# EAGLE design LED_Light_Quad (EAGLE 6.5.0)
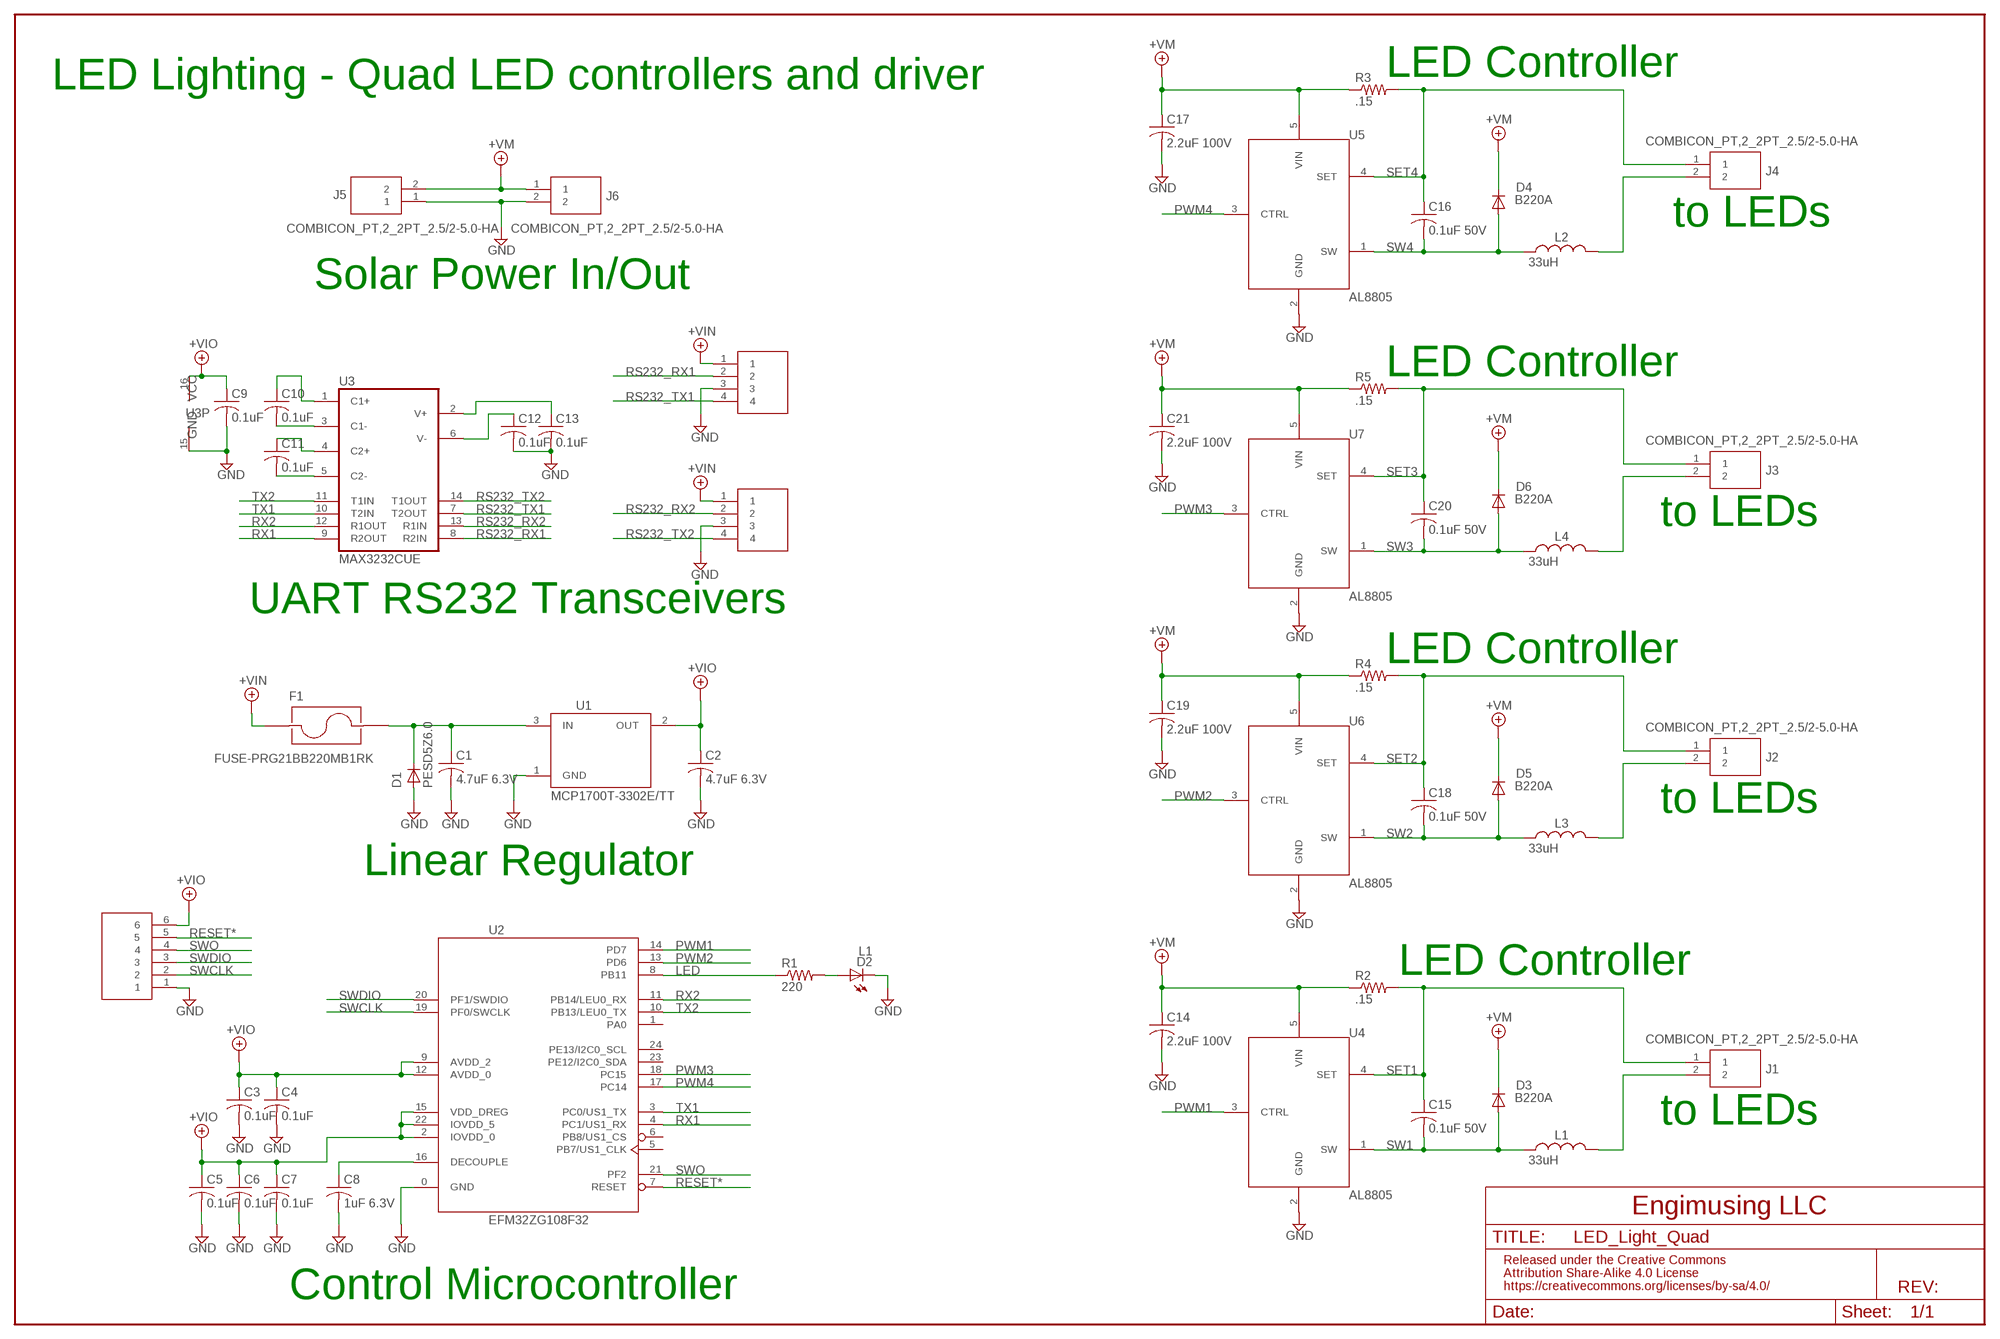
[diagram p0: schematic, sheet 1]

## Parts
C1  4.7uF 6.3V  C-USC0603  [C0603]
C2  4.7uF 6.3V  C-USC0603  [C0603]
C3  0.1uF  C-USC0402  [C0402]
C4  0.1uF  C-USC0402  [C0402]
C5  0.1uF  C-USC0402  [C0402]
C6  0.1uF  C-USC0402  [C0402]
C7  0.1uF  C-USC0402  [C0402]
C8  1uF 6.3V  C-USC0603  [C0603]
C9  0.1uF  C-USC0402  [C0402]
C10  0.1uF  C-USC0402  [C0402]
C11  0.1uF  C-USC0402  [C0402]
C12  0.1uF  C-USC0402  [C0402]
C13  0.1uF  C-USC0402  [C0402]
C14  2.2uF 100V  C-USC1210K  [C1210K]
C15  0.1uF 50V  C-USC0805  [C0805]
C16  0.1uF 50V  C-USC0805  [C0805]
C17  2.2uF 100V  C-USC1210K  [C1210K]
C18  0.1uF 50V  C-USC0805  [C0805]
C19  2.2uF 100V  C-USC1210K  [C1210K]
C20  0.1uF 50V  C-USC0805  [C0805]
C21  2.2uF 100V  C-USC1210K  [C1210K]
D1  PESD5Z6.0  DIODESOD-523  [SOD-523]
D2  L1  LEDCHIP-LED0603  [CHIP-LED0603]
D3  B220A  DIODE  [DO214SMA]
D4  B220A  DIODE  [DO214SMA]
D5  B220A  DIODE  [DO214SMA]
D6  B220A  DIODE  [DO214SMA]
F1  FUSE-PRG21BB220MB1RK  [L0805_2.5]
J1  COMBICON_PT,2_2PT_2.5/2-5.0-HA  [PT_2,5/2-5.0-HA]
J2  COMBICON_PT,2_2PT_2.5/2-5.0-HA  [PT_2,5/2-5.0-HA]
J3  COMBICON_PT,2_2PT_2.5/2-5.0-HA  [PT_2,5/2-5.0-HA]
J4  COMBICON_PT,2_2PT_2.5/2-5.0-HA  [PT_2,5/2-5.0-HA]
J5  COMBICON_PT,2_2PT_2.5/2-5.0-HA  [PT_2,5/2-5.0-HA]
J6  COMBICON_PT,2_2PT_2.5/2-5.0-HA  [PT_2,5/2-5.0-HA]
L1  33uH  INDUCTOR  [SRN6045]
L2  33uH  INDUCTOR  [SRN6045]
L3  33uH  INDUCTOR  [SRN6045]
L4  33uH  INDUCTOR  [SRN6045]
P1  DF11-4_STRAIGHT_PIN  [DF11SP-4-H]
P2  DF11-4_STRAIGHT_PIN  [DF11SP-4-H]
P3  DF11-6_STRAIGHT_PIN  [DF11SP-6-H]
R1  220  R-USR0402  [R0402]
R2  .15  R-USR0805  [R0805]
R3  .15  R-USR0805  [R0805]
R4  .15  R-USR0805  [R0805]
R5  .15  R-USR0805  [R0805]
U1  MCP1700T-3302E/TT  MCP1700-3302E/TT  [SOT23A]
U2  EFM32ZG108F32  [QFN24_5X5]
U3  MAX3232CUE  [TSSOP16]
U4  AL8805  [SOT-23-5A]
U5  AL8805  [SOT-23-5A]
U6  AL8805  [SOT-23-5A]
U7  AL8805  [SOT-23-5A]

## Nets
+VIN: F1.2(A) P1.1 P2.1
+VIO: C2.1 C3.1 C4.1 C5.1 C6.1 C7.1 C9.1 P3.6 U1.2(OUT) U2.2(IOVDD_0) U2.9(AVDD_2) U2.12(AVDD_0) U2.15(VDD_DREG) U2.22(IOVDD_5) U3.16(VCC)
+VM: C14.1 C17.1 C19.1 C21.1 D3.1(C) D4.1(C) D5.1(C) D6.1(C) J5.2 J6.1 R2.1 R3.1 R4.1 R5.1 U4.5(VIN) U5.5(VIN) U6.5(VIN) U7.5(VIN)
GND: C1.2 C2.2 C3.2 C4.2 C5.2 C6.2 C7.2 C8.2 C9.2 C12.2 C13.2 C14.2 C17.2 C19.2 C21.2 D1.A D2.C J5.1 J6.2 P1.3 P2.3 P3.1 U1.1(GND) U2.0(GND) U3.15(GND) U4.2(GND) U5.2(GND) U6.2(GND) U7.2(GND)
LED: R1.1 U2.8(PB11)
N$1: C8.1 U2.16(DECOUPLE)
N$2: J1.2 L1.2
N$3: J4.2 L2.2
N$4: J2.2 L3.2
N$5: D2.A R1.2
N$6: J3.2 L4.2
N$43: C10.2 U3.3(C1-)
N$44: C10.1 U3.1(C1+)
N$45: C11.2 U3.5(C2-)
N$46: C11.1 U3.4(C2+)
N$54: C13.1 U3.2(V+)
N$55: C12.1 U3.6(V-)
PWM1: U2.14(PD7) U4.3(CTRL)
PWM2: U2.13(PD6) U6.3(CTRL)
PWM3: U2.18(PC15) U7.3(CTRL)
PWM4: U2.17(PC14) U5.3(CTRL)
RESET*: P3.5 U2.7(RESET)
RS232_RX1: P2.2 U3.8(R2IN)
RS232_RX2: P1.2 U3.13(R1IN)
RS232_TX1: P2.4 U3.7(T2OUT)
RS232_TX2: P1.4 U3.14(T1OUT)
RX1: U2.4(PC1/US1_RX) U3.9(R2OUT)
RX2: U2.11(PB14/LEU0_RX) U3.12(R1OUT)
SET1: C15.1 J1.1 R2.2 U4.4(SET)
SET2: C18.1 J2.1 R4.2 U6.4(SET)
SET3: C20.1 J3.1 R5.2 U7.4(SET)
SET4: C16.1 J4.1 R3.2 U5.4(SET)
SW1: C15.2 D3.2(A) L1.1 U4.1(SW)
SW2: C18.2 D5.2(A) L3.1 U6.1(SW)
SW3: C20.2 D6.2(A) L4.1 U7.1(SW)
SW4: C16.2 D4.2(A) L2.1 U5.1(SW)
SWCLK: P3.2 U2.19(PF0/SWCLK)
SWDIO: P3.3 U2.20(PF1/SWDIO)
SWO: P3.4 U2.21(PF2)
TX1: U2.3(PC0/US1_TX) U3.10(T2IN)
TX2: U2.10(PB13/LEU0_TX) U3.11(T1IN)
VIN: C1.1 D1.K(C) F1.1(B) U1.3(IN)
Unconnected: U2.1(PA0) U2.5(PB7/US1_CLK) U2.6(PB8/US1_CS) U2.23(PE12/I2C0_SDA) U2.24(PE13/I2C0_SCL)

## Notes on the sheet
- LED Lighting - Quad LED controllers and driver | LED Controller
- to LEDs
- Solar Power In/Out
- LED Controller
- to LEDs
- UART RS232 Transceivers
- LED Controller
- to LEDs
- Linear Regulator
- LED Controller
- to LEDs
- Control Microcontroller

## Library data of the parts
C1-C7 C9-C13 = cc_rcl:C-US: CAPACITOR, American symbol
C8 C14-C21 = Engimusing:C-US: CAPACITOR, American symbol
D1 D3-D6 = Engimusing:DIODE: Diode SMA Model Volts Amps Type Vf Vr Digikey # Notes SSA34-E3 40V 3A Schottky 480mV @ 3A 200uA @ 40V SSA34-E3/61TGITR-ND CDBA120-G 20V 1A Schottky 500mV @ 1A 500uA @ 20V 641-1014-6-ND REEL MBRA210 10V 2A Schottky 350mV @ 2A 700uA @ 10V MBRA210LT3 SOD-123 Model Volts Amps Type Vf Vr Order # Notes BAT54T1G 30V 200mA Schottky 800mV @ 200mA 2uA @ 25V BAT54T1GOSTR-ND B0530W 30V 500mA Schottky 430mV @ 500mA 130uA @ 30V B0530W-FDICT-ND REEL MBR120 1A 20V Schottky 340mV @ 1A MBR120VLSFT1GOSCT-ND SOD-323 Model Volts Amps Type Vf Vr Order # Notes PMEG2005EJ 20V 500mA Schottky 355mV @ 500mA 568-4110-1-ND ZLLS410 10V 570mA Schottky 380mV @ 570mA ZLLS410CT-ND 1N4148WS 75V 150mA Silicon/Simple 1V 1N4148WSFSCT-ND REEL SOD-523 Model Volts Amps Type Vf Vr Order # Notes BAT54XV2 30V 200mA Schottky 0.8V @ 100mA BAT54XV2CT-ND TB751S 30V 30mA Schottky RB751S-40TE61CT-ND SOT23-R/W (R = Solder Paste/Reflow Ovens, W = Hand-Soldering) Model Volts Amps Type Vf Vr Order # Notes BAT54FILM 40V 300mA Schottky 497-7162-1-ND
D2 = led:LED: LED OSRAM: - CHIPLED LG R971, LG N971, LY N971, LG Q971, LY Q971, LO R971, LY R971 LH N974, LH R974 LS Q976, LO Q976, LY Q976 LO Q996 - Hyper CHIPLED LW Q18S LB Q993, LB Q99A, LB R99A - SideLED LS A670, LO A670, LY A670, LG A670, LP A670 LB A673, LV A673, LT A673, LW A673 LH A674 LY A675 LS A676, LA A676, LO A676, LY A676, LW A676 LS A679, LY A679, LG A679 - Hyper Micro SIDELED® LS Y876, LA Y876, LO Y876, LY Y876 LT Y87S - SmartLED LW L88C, LW L88S LB L89C, LB L89S, LG L890 LS L89K, LO L89K, LY L89K LS L896, LA L896, LO L896, LY L896 - TOPLED LS T670, LO T670, LY T670, LG T670, LP T670 LSG T670, LSP T670, LSY T670, LOP T670, LYG T670 LG T671, LOG T671, LSG T671 LB T673, LV T673, LT T673, LW T673 LH T674 LS T676, LA T676, LO T676, LY T676, LB T676, LH T676, LSB T676, LW T676 LB T67C, LV T67C, LT T67C, LS T67K, LO T67K, LY T67K, LW E67C LS E67B, LA E67B, LO E67B, LY E67B, LB E67C, LV E67C, LT E67C LW T67C LS T679, LY T679, LG T679 LS T770, LO T770, LY T770, LG T770, LP T770 LB T773, LV T773, LT T773, LW T773 LH T774 LS E675, LA E675, LY E675, LS T675 LS T776, LA T776, LO T776, LY T776, LB T776 LHGB T686 LT T68C, LB T68C - Hyper Mini TOPLED® LB M676 - Mini TOPLED Santana® LG M470 LS M47K, LO M47K, LY M47K Source: http://www.osram.convergy.de LUXEON: - LUMILED® LXK2-PW12-R00, LXK2-PW12-S00, LXK2-PW14-U00, LXK2-PW14-V00 LXK2-PM12-R00, LXK2-PM12-S00, LXK2-PM14-U00 LXK2-PE12-Q00, LXK2-PE12-R00, LXK2-PE12-S00, LXK2-PE14-T00, LXK2-PE14-U00 LXK2-PB12-K00, LXK2-PB12-L00, LXK2-PB12-M00, LXK2-PB14-N00, LXK2-PB14-P00, LXK2-PB14-Q00 LXK2-PR12-L00, LXK2-PR12-M00, LXK2-PR14-Q00, LXK2-PR14-R00 LXK2-PD12-Q00, LXK2-PD12-R00, LXK2-PD12-S00 LXK2-PH12-R00, LXK2-PH12-S00 LXK2-PL12-P00, LXK2-PL12-Q00, LXK2-PL12-R00 Source: www.luxeon.com KINGBRIGHT: KA-3528ASYC Source: www.kingbright.com
F1 = Engimusing:FUSE
J1-J6 = Engimusing:COMBICON_PT,2_2: CONNECTOR 2POS SCREW CONECTON
L1-L4 = Engimusing:INDUCTOR
P1 P2 = engimusing_conectors:DF11-4: CONNECTOR 4 POS SM
P3 = engimusing_conectors:DF11-6: CONNEECTOR 6 POS SM
R1 = cc_rcl:R-US: RESISTOR, American symbol
R2-R5 = Engimusing:R-US: RESISTOR, American symbol
U1 = Engimusing:MCP1700
U2 = Engimusing:EFM32ZG108
U3 = maxim:MAX3232*: True RS-232 Transceivers 3.0V to 5.5V, Low-Power up to 1Mbps, Using Four 0.1µF External Capacitors Source: http://pdfserv.maxim-ic.com/en/ds/MAX3222-MAX3241.pdf; MF: MAXIM; MPN: MAX3232CUE+; OC_FARNELL: 1593350; OC_NEWARK: 68K4629
U4-U7 = Engimusing:AL8805

## Net classes
2 gnd: width 0.254 mm, drill 0.61 mm, clearance 0.254 mm

## Board
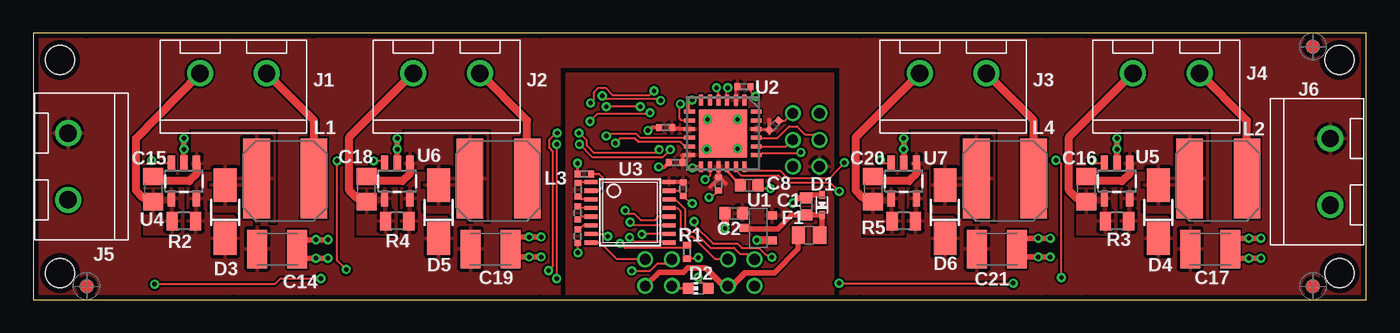
[diagram p1: board, top side]
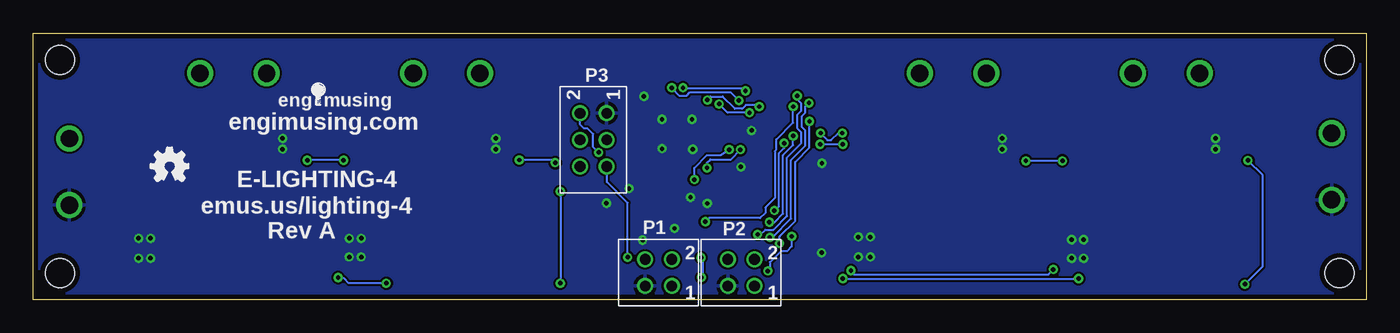
[diagram p2: board, bottom side, seen from below]

Size 100 x 20 mm. Coordinates in mm from the lower left corner, seen from the top.
Outline: 4,0 15,0
Outline: 15,20 4,20
Outline: 76,0 96,0
Outline: 96,20 76,20
Outline: 21,0 38,0
Outline: 38,20 21,20
Outline: 62,0 79,0
Outline: 79,20 62,20
Outline: 0,0 100,0 100,20 0,20 0,0
Copper layers (1*16): Top 0.0356mm / dielectric 1.5011mm / Bottom 0.0356mm
Design rules "OshPark-2Lyr *": minimum track width 6mil, minimum drill 13mil, track to track 6mil, track to pad 6mil, pad to pad 6mil, via to via 6mil, smd to smd 6mil, copper to edge 15mil, drill to drill 6mil, minimum pad ring 7mil, minimum via ring 7mil, stop-mask expansion 3mil, vias tented up to drill 13mil, thermal gap 10mil
Holes 2.2 mm at 98,18 2,2 2,18 98,2

### Footprints (pad centres in the part's own frame; a part is rotated, then mirrored left to right if it is on the bottom)
C0603 = smd 0.825 x 0.925: 1 -0.65,0; 2 0.65,0
C0402 = smd 0.45 x 0.5: 1 -0.5,0; 2 0.5,0
C1210K = smd 1.5 x 2.9: 1 -1.5,0; 2 1.5,0
C0805 = smd 1.3 x 1.5: 1 -0.95,0; 2 0.95,0
SOD-523 = smd 0.4 x 0.6: A 0,-0.75; K 0,0.75
CHIP-LED0603 = smd 0.8 x 0.8: A 0,-0.75; C 0,0.75
DO214SMA = smd 2.5 x 1.7: 1 -2,0; 2 2,0
L0805_2.5 = smd 1 x 1.3: 1 -0.8,0; 2 0.8,0
PT_2,5/2-5.0-HA = drill 1.3: 1 -2.5,0; 2 2.5,0
SRN6045 = smd 2 x 6: 1 -2.15,0; 2 2.15,0
DF11SP-4-H = drill 0.8: 1 1,-1; 2 1,1; 3 -1,-1; 4 -1,1
DF11SP-6-H = drill 0.8: 1 2,-1; 2 2,1; 3 0,-1; 4 0,1; 5 -2,-1; 6 -2,1
R0402 = smd 0.5 x 0.6: 1 -0.5,0; 2 0.5,0
R0805 = smd 0.85 x 1.4: 1 -0.875,0; 2 0.875,0
SOT23A = smd 0.6 x 0.7: 1 -0.95,-1.05; 2 0.95,-1.05; 3 0,1.05
QFN24_5X5 = smd 3.6 x 3.6: 0 0,0 | smd 0.8 x 0.3: 1 -2.5,1.625; 2 -2.5,0.975; 3 -2.5,0.325; 4 -2.5,-0.325; 5 -2.5,-0.975; 6 -2.5,-1.625; 13 2.5,-1.625; 14 2.5,-0.975; 15 2.5,-0.325; 16 2.5,0.325; 17 2.5,0.975; 18 2.5,1.625 | smd 0.3 x 0.8: 7 -1.625,-2.5; 8 -0.975,-2.5; 9 -0.325,-2.5; 10 0.325,-2.5; 11 0.975,-2.5; 12 1.625,-2.5; 19 1.625,2.5; 20 0.975,2.5; 21 0.325,2.5; 22 -0.325,2.5; 23 -0.975,2.5; 24 -1.625,2.5
TSSOP16 = smd 0.305 x 0.991: 1 -2.275,-2.918; 2 -1.625,-2.918; 3 -0.975,-2.918; 4 -0.325,-2.918; 5 0.325,-2.918; 6 0.975,-2.918; 7 1.625,-2.918; 8 2.275,-2.918; 9 2.275,2.918; 10 1.625,2.918; 11 0.975,2.918; 12 0.325,2.918; 13 -0.325,2.918; 14 -0.975,2.918; 15 -1.625,2.918; 16 -2.275,2.918
SOT-23-5A = smd 0.55 x 1.2: 1 -0.95,-1.3; 2 0,-1.3; 3 0.95,-1.3; 4 0.95,1.3; 5 -0.95,1.3

### Placement (x,y rotation side)
C1  57.98,7 90 top
C2  52.54,6.48 180 top
C3  47.43,12.92 180 top
C4  48.19,10.29 180 top
C5  51.41,8.68 270 top
C6  55.58,13.07 45 top
C7  53.32,15.99 0 top
C8  53.71,8.58 0 top
C9  48.75,8.29 270 top
C10  40.87,8.24 270 top
C11  40.84,6.5 270 top
C12  40.84,4.75 270 top
C13  41.33,9.44 180 top
C14  18.3,3.8 0 top
C15  9,8.3 90 top
C16  79,8.3 90 top
C17  88.3,3.8 0 top
C18  25,8.3 90 top
C19  34.3,3.8 0 top
C20  63,8.3 90 top
C21  72.3,3.8 0 top
D1  59.18,7.1 180 top
D2  49.89,0.85 90 top
D3  14.4,6.6 90 top
D4  84.4,6.6 90 top
D5  30.4,6.6 90 top
D6  68.4,6.6 90 top
F1  58.2,4.83 180 top
J1  15,17 0 top
J2  31,17 0 top
J3  69,17 0 top
J4  85,17 0 top
J5  2.6,10 90 top
J6  97.3,9.6 270 top
L1  18.9,9.1 0 top
L2  88.9,9.1 0 top
L3  34.9,9.1 0 top
L4  72.9,9.1 0 top
P1  53.1,2.02 0 bottom
P2  46.9,2.02 0 bottom
P3  57.98,12 90 bottom
R1  49.06,3.58 270 top
R2  11.3,5.9 180 top
R3  81.3,5.9 180 top
R4  27.3,5.9 180 top
R5  65.3,5.9 180 top
U1  54.38,5.38 90 top
U2  51.73,12.48 270 top
U3  44.77,6.55 270 top
U4  11.3,8.9 180 top
U5  81.3,8.9 180 top
U6  27.3,8.9 180 top
U7  65.3,8.9 180 top
U$1  [FIDUCIAL_G10]  4,1 0 top
U$2  [FIDUCIAL_G10]  96,19 0 top
U$3  [OSHW_FILLX100_NOTEXT]  91.19,8.89 0 bottom
U$4  [LOGO]  77.25,14.84 0 bottom
U$5  [FIDUCIAL_G10]  96,1 0 top

### Tracks (layer width: path | path; a pad name or v marks a point on that pad's centre or on a via)
+VIN
  Top 0.406: P2.1 46.92,2.05 48.76,2.05 49.1,2.38 50.44,2.38 51.81,1.01 P1.1 52.42,1.02 53.4,2 55.59,2 57.36,3.81 57.36,4.93 F1.2
+VIO
  Top 0.152: 47.72,8.83 U3.16 | U2.22 55.14,12.81 C6.1 | U2.2 52.7,15.87 C7.1
  Top 0.3: 47.72,8.83 48.63,8.82 48.66,8.79 C9.1 48.78,8.82 | U2.9 47.93,12.81 C3.1 | 51.94,8.71 51.4,9.24 U2.15 51.4,9.41 C5.1 51.41,9.08 50.8,8.48 | C6.1 55.23,13.5 55.22,13.5 | U2.12 48.76,10.86 48.7,10.8 48.7,10.3 C4.1
  pour Top (rank 2): 40,0 40,17 60,17 60,0
+VM
  pour Top: 11.7,8.3 11.7,2.1 18.2,2.1 18.2,5.4 15.7,5.4 15.1,6.1 13.5,6.1 12.9,6.5 12.9,8.3
  pour Top: 27.7,8.3 27.7,2.1 34.2,2.1 34.2,5.5 31.7,5.5 31.1,6.1 29.5,6.1 28.8,6.6 28.8,8.4
  pour Top: 65.7,8.3 65.7,2.1 72.2,2.1 72.2,5.5 69.7,5.5 69.1,6.1 67.5,6.1 66.9,6.6 66.9,8.3
  pour Top: 81.7,8.3 81.7,2.1 88.2,2.1 88.2,5.5 85.7,5.5 85.1,6.1 83.4,6.1 82.9,6.5 82.9,8.3
  pour Top (rank 2): 0,20 0,0 39.5,0 39.5,17.5 60.5,17.5 60.5,0 100,0 100,20
GND  (via drill 0.33 pad 0.61)
  Top 0.152: U3.15 48.37,8.18 C9.2 | v50.7,7.68 51.31,8.01 C5.2 | C6.2 56.41,13.43 P3.1 | C7.2 53.82,15.61 v54.19,15.26
  Top 0.2: C12.2 v40.86,3.51 | C13.2 v40.83,10.24 | D2.C 48.07,0.85 P2.3 | C8.2 54.72,8.35 v55.31,8.33 | C9.2 49.36,7.22 v49.44,7.22 | U2.0 51.73,13.53 v50.58,13.53 50.58,11.28 v50.53,11.28 50.53,11.33 v52.83,11.33 v52.83,13.53 52.83,12.48 U2.0
  Top 0.3: C3.2 46.43,12.92 v46.11,12.71 | v46.91,9.96 47.36,9.96 C4.2
  Top 0.406: D1.A 58.33,7.84 C1.2 57.42,7.65 v57.01,7.24 | U4.2 v11.3,11.3 v11.3,12.1 | v22.1,3.1 v21.2,3.1 19.8,3.1 C14.2 19.9,3.8 19.9,4.5 v21.2,4.5 v22.1,4.5 | U6.2 v27.3,11.3 v27.3,12.1 | v38.1,4.7 v37.2,4.7 35.8,4.7 C19.2 35.9,3.8 35.9,3.2 v37.2,3.2 v38.1,3.2 | U7.2 v65.3,11.3 v65.3,12.1 | 73.9,3.8 73.9,4.6 v75.4,4.6 v76.3,4.6 | C21.2 73.9,3.8 | 73.9,3.8 73.9,3.2 v75.4,3.2 v76.3,3.2 | U5.2 v81.3,11.3 v81.3,12.1 | v92.1,4.6 v91.2,4.6 89.7,4.6 89.7,3.8 C17.2 89.9,3.8 89.9,3.1 v91.2,3.1 v92.1,3.1
  Top 0.61: U1.1 54.3,4.44 54.29,4.43 v54.28,4.46 | C2.2 v51.89,5.34
  pour Bottom (rank 2): 0,0 0,20 100,20 100,0
LED  (via drill 0.33 pad 0.61)
  Top 0.152: R1.1 49.06,4.03 48.74,3.87 44.36,3.87 v44.02,4.21 | U2.8 48.64,13.46 48.48,13.62 48.48,14.57 v48.55,14.69 | v46.27,14.04 46.23,14.04 46.11,13.92 42.3,13.92 v41.77,13.39
  Bottom 0.152: v44.02,4.21 44.02,4.74 42.84,5.92 42.84,10.34 41.77,11.41 v41.77,13.39 | v46.27,14.04 47.91,14.04 v48.55,14.69
N$1
  Top 0.2: U2.16 52.05,9.68 52.76,8.86 52.87,8.76 C8.1
N$2
  Top 0.61: L1.2 21.05,13.45 J1.2
N$3
  Top 0.61: L2.2 91.05,13.45 J4.2
N$4
  Top 0.61: L3.2 37.05,13.45 J2.2
N$5  (via drill 0.33 pad 0.61)
  Top 0.152: D2.A 50.52,0.94 50.07,1.39 v49.88,1.66 | R1.2 49.8,3.08 49.81,3.07 v49.9,3.15
  Bottom 0.152: v49.9,3.15 49.78,3.04 49.78,1.75 v49.88,1.66
N$6
  Top 0.61: L4.2 75.05,13.45 J3.2
N$43
  Top 0.2: U3.3 41.43,7.57 41.12,7.57 41.01,7.68 C10.2
N$44
  Top 0.2: U3.1 41,8.83 C10.1
N$45
  Top 0.2: U3.5 41.11,6.23 C11.2
N$46
  Top 0.2: U3.4 40.93,6.92 C11.1
N$54
  Top 0.2: U3.2 42.45,8.18 42.71,8.4 42.71,9.17 42.46,9.43 C13.1
N$55
  Top 0.2: U3.6 41.29,5.58 40.97,5.25 C12.1
PWM1  (via drill 0.33 pad 0.61)
  Top 0.152: U2.14 50.75,9.27 v50.41,9.01 | v47.79,11.26 47.22,10.69 41.95,10.69 v40.97,11.67 | v39.27,11.67 v39.27,1.57 | v21.57,1.57 18.53,1.57 18.11,1.15 v9.1,1.15 | U4.3 9.12,10.2 v8.87,10.45
  Bottom 0.152: v50.41,9.01 50.41,9.9 49.47,10.84 48.44,10.84 v47.79,11.26 | v40.97,11.67 v39.27,11.67 | v39.27,1.57 v21.57,1.57 | v9.1,1.15 7.77,2.49 7.77,9.34 v8.87,10.45
PWM2  (via drill 0.33 pad 0.61)
  Top 0.152: U2.13 49.4,9.98 v49.46,9.89 | v46.95,11.26 46.95,11.25 46.72,11.02 42.08,11.02 41.54,11.55 41.54,11.93 40.97,12.5 v40.93,12.5 | v39.3,12.5 39.23,12.5 38.69,11.97 38.69,11.4 38.96,11.13 38.96,2.49 v38.66,2.18 | v23.47,2.26 22.79,2.94 v22.79,10.42 | U6.3 26.2,10.4 | 26.2,10.4 | 26.2,10.4 25.59,10.4 v25.53,10.42
  Bottom 0.152: v49.46,9.89 49.46,10.28 49.2,10.53 47.64,10.53 v46.95,11.26 | v40.93,12.5 40.93,12.47 40.44,11.97 40.14,11.97 39.61,12.5 v39.3,12.5 | v38.66,2.18 38.66,2.07 38.47,1.88 23.84,1.88 23.84,1.89 v23.47,2.26 | v22.79,10.42 v25.53,10.42
PWM3  (via drill 0.33 pad 0.61)
  Top 0.152: U2.18 53.35,9.72 53.39,9.69 56.02,9.69 56.59,9.11 59.78,9.11 v60.84,10.28 | U7.3 63.73,10.2 v63.53,10.48
  Bottom 0.152: v60.84,10.28 60.9,10.3 61.08,10.48 v63.53,10.48
PWM4  (via drill 0.33 pad 0.61)
  Top 0.152: U2.17 52.7,9.72 53.1,9.32 55.89,9.32 56.4,8.81 59.77,8.81 v60.46,8.12 | v60.46,1.23 v73.52,1.23 | v77.13,1.65 77.13,10.17 77,10.3 v76.73,10.47 | U5.3 79.68,10.2 v79.45,10.47
  Bottom 0.152: v60.46,8.12 v60.46,1.23 | v73.52,1.23 76.33,1.23 76.7,1.6 76.9,1.61 77.09,1.61 v77.13,1.65 | v76.73,10.47 v79.45,10.47
RESET*  (via drill 0.33 pad 0.61)
  Top 0.152: U2.7 49.23,14.77 v49.43,14.99 | v45.54,14.5 v42.99,14.5 | v49.58,5.85 49.58,5.62 50.99,4.21 52.82,4.21 53.16,3.87 54.46,3.87 54.95,3.37 55.22,3.37 v55.41,3.18
  Bottom 0.152: v49.43,14.99 49.43,15.03 49.2,15.26 48.29,15.26 47.37,14.34 46.8,14.34 46.53,14.61 45.85,14.61 45.73,14.5 v45.54,14.5 | v49.58,5.85 49.31,6.11 45.47,6.11 45.09,6.5 45.09,6.91 44.36,7.64 44.36,11.14 44.25,11.26 44.25,12.02 42.99,13.28 v42.99,14.5 | v55.41,3.18 55.41,7.26 56.97,8.82 P3.5
RS232_RX1
  Top 0.152: P2.2 43.8,3.02 42.57,4.25 41.88,4.25 U3.8
RS232_RX2
  Top 0.152: U3.13 48.32,6.88 48.55,6.65 48.55,5.15 49,4.7 49.5,4.7 51.18,3.02 P1.2
RS232_TX1  (via drill 0.33 pad 0.61)
  Top 0.152: U3.7 42.92,4.93 v43.1,4.74 | v44.89,2.15 46.27,2.15 46.84,2.72 47.6,2.72 P2.4
  Bottom 0.152: v43.1,4.74 43.1,3.98 43.45,3.64 43.9,3.64 44.74,2.8 44.74,2.3 v44.89,2.15
RS232_TX2
  Top 0.152: U3.14 48.17,7.53 48.9,6.8 48.9,5.3 49.1,5.1 49.6,5.1 50.8,3.9 52.58,3.9 53.03,3.45 53.52,3.45 P1.4
RX1  (via drill 0.33 pad 0.61)
  Top 0.152: U3.9 47.3,4.3 47.28,4.32 45.09,4.32 v44.74,4.67 | U2.4 51.41,15.71 v51.26,15.91 | v41.81,14.76 42.08,15.03 42.08,15.56 42.42,15.91 42.91,15.91 43.45,15.37 46.23,15.37 v46.57,15.68
  Bottom 0.152: v44.74,4.67 44.55,4.67 43.14,6.08 43.14,10.49 42.08,11.56 42.08,12.71 42.34,12.97 42.34,13.77 42.08,14.04 42.08,14.5 v41.81,14.76 | v51.26,15.91 51.26,15.87 46.91,15.87 46.69,15.64 46.65,15.64 v46.57,15.68
RX2  (via drill 0.33 pad 0.61)
  Top 0.152: 47.8,6.23 U3.12 46.88,6.23 46.61,5.96 45.58,5.96 45.12,6.42 44.67,6.42 v44.4,6.69 | U2.11 49.14,11.51 48.86,11.52 48.55,11.83 45.39,11.83 45.12,12.1 44.02,12.1 v43.67,11.75
  Bottom 0.152: v44.4,6.69 44.36,6.69 44.06,6.99 44.06,10.99 43.67,11.37 v43.67,11.75
SET1
  Top 0.61: C15.1 8.25,7.65 7.7,8.2 7.7,12.1 J1.1
  pour Top: 8.3,8.4 8.3,4.9 11.3,4.9 11.3,8.4
SET2
  Top 0.61: C18.1 24.25,7.65 23.7,8.2 23.7,12.2 J2.1
  pour Top: 24.3,8.4 24.3,4.9 27.3,4.9 27.3,8.4
SET3
  Top 0.61: C20.1 62.25,7.65 61.7,8.2 61.7,12.2 J3.1
  pour Top: 62.3,8.4 62.3,4.9 65.3,4.9 65.3,8.4
SET4
  Top 0.61: C16.1 78.25,7.65 77.7,8.2 77.7,12.2 J4.1
  pour Top: 78.3,8.4 78.3,4.9 81.3,4.9 81.3,8.4
SW1
  Top 0.61: U4.1 12.25,9.45 11.7,8.9 9.05,8.9 C15.2
  pour Top: 18.1,12.6 18.1,5.8 15.9,5.8 15.8,5.9 15.3,6.6 13.6,6.6 13.3,6.8 13.3,9.8 11.9,9.8 11.9,12.6
SW2
  Top 0.61: U6.1 28.25,9.45 27.7,8.9 25.05,8.9 C18.2
  pour Top: 34.1,12.6 34.1,5.9 31.9,5.9 31.2,6.5 29.5,6.5 29.3,6.7 29.3,9.8 27.9,9.8 27.9,12.6
SW3
  Top 0.61: U7.1 66.25,9.45 65.7,8.9 63.05,8.9 C20.2
  pour Top: 72.1,12.6 72.1,5.9 69.9,5.9 69.2,6.5 67.5,6.5 67.3,6.7 67.3,9.8 65.9,9.8 65.9,12.6
SW4
  Top 0.61: U5.1 82.25,9.45 81.7,8.9 79.05,8.9 C16.2
  pour Top: 88.1,12.6 88.1,5.9 85.9,5.9 85.3,6.5 83.6,6.5 83.3,6.7 83.3,9.8 81.9,9.8 81.9,12.6
SWCLK  (via drill 0.33 pad 0.61)
  Top 0.152: U2.19 54.57,10.88 54.71,11.01 57.54,11.01 v57.58,11.05
  Bottom 0.152: v57.58,11.05 57.7,11.14 58,11.45 58,12.44 58.42,12.86 58.69,12.86 58.99,13.16 58.99,13.99 P3.2
SWDIO
  Top 0.152: U2.20 56.49,11.51 P3.3
SWO
  Top 0.152: U2.21 54.46,12.17 54.51,12.12 55.82,12.12 56.7,13 57.3,13 57.9,12.4 58.58,12.4 P3.4
TX1  (via drill 0.33 pad 0.61)
  Top 0.152: U3.10 45.69,4.93 v45.66,4.89 | U2.3 52.02,14.98 52.02,15.71 v52.09,15.91 | v47.07,14.95 46.99,15.07 42.91,15.07 v42.69,15.3
  Bottom 0.152: v45.66,4.89 45.43,4.89 45.09,5.24 44.48,5.24 43.45,6.27 43.45,10.69 42.38,11.75 42.38,12.55 42.69,12.86 42.69,13.89 42.38,14.19 42.38,14.72 42.72,15.07 v42.69,15.3 | v52.09,15.91 52.09,15.87 51.56,15.33 50.95,15.33 50.72,15.56 47.68,15.56 v47.07,14.95
TX2  (via drill 0.33 pad 0.61)
  Top 0.152: U3.11 45.01,5.58 v44.78,5.81 | U2.10 48.95,12.16 48.97,12.13 45.54,12.13 45.24,12.44 43.07,12.44 v42.99,12.29
  Bottom 0.152: v44.78,5.81 44.4,5.81 43.75,6.46 43.75,10.84 42.99,11.6 v42.99,12.29
VIN
  Top 0.406: F1.1 59.18,4.75 D1.K C1.1 56.9,6.34 55.87,5.32 53.28,5.32 53.24,5.31 U1.3

### Text on the board
bPlace: engimusing.com | E-LIGHTING-4 | emus.us/lighting-4 | Rev A